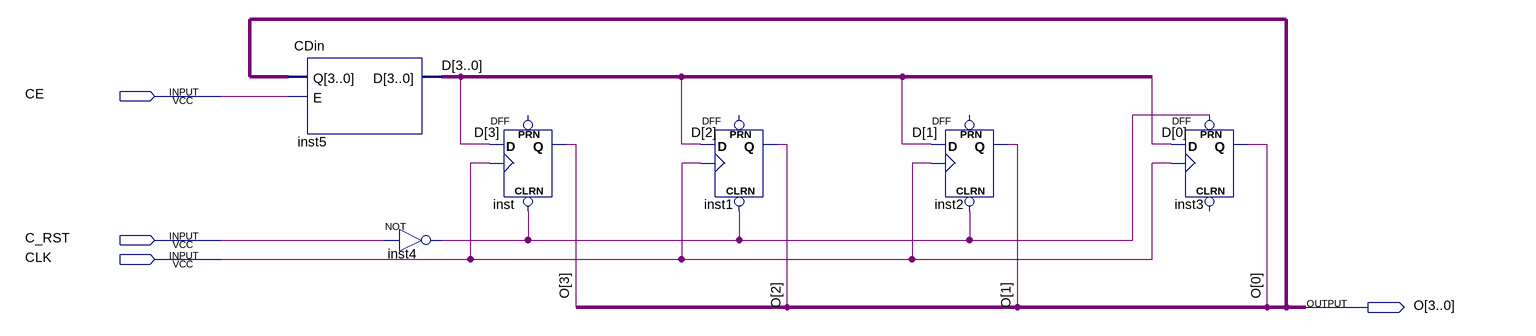
[diagram p0: schematic sheet]
// Quartus schematic Counter.bdf as structural Verilog: 6 symbols, 4 pins
module Counter (
  input  CE,
  input  C_RST,
  input  CLK,
  output [3:0] O
);

  wire inst4_out;
  wire [3:0] D;

  CDin inst5 (.Q(O), .E(CE), .D(D));
  not inst4 (inst4_out, C_RST);
  DFF inst (.CLRN(inst4_out), .CLK(CLK), .D(D[3]), .Q(O[3]));  // open: PRN
  DFF inst1 (.CLRN(inst4_out), .CLK(CLK), .D(D[2]), .Q(O[2]));  // open: PRN
  DFF inst2 (.CLRN(inst4_out), .CLK(CLK), .D(D[1]), .Q(O[1]));  // open: PRN
  DFF inst3 (.CLK(CLK), .D(D[0]), .PRN(inst4_out), .Q(O[0]));  // open: CLRN
endmodule
